# EAGLE board Xibeca44 (EAGLE 9.6.2)
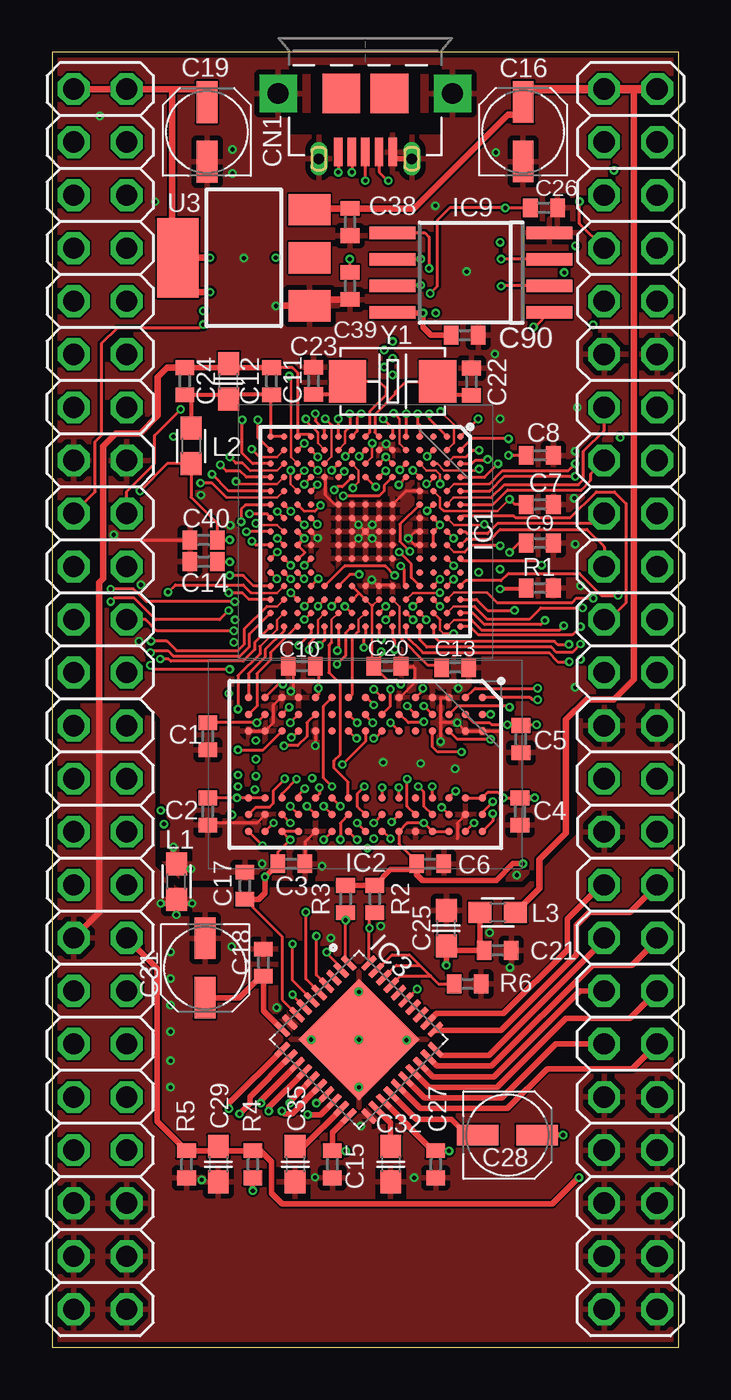
[diagram p2: board, top side]
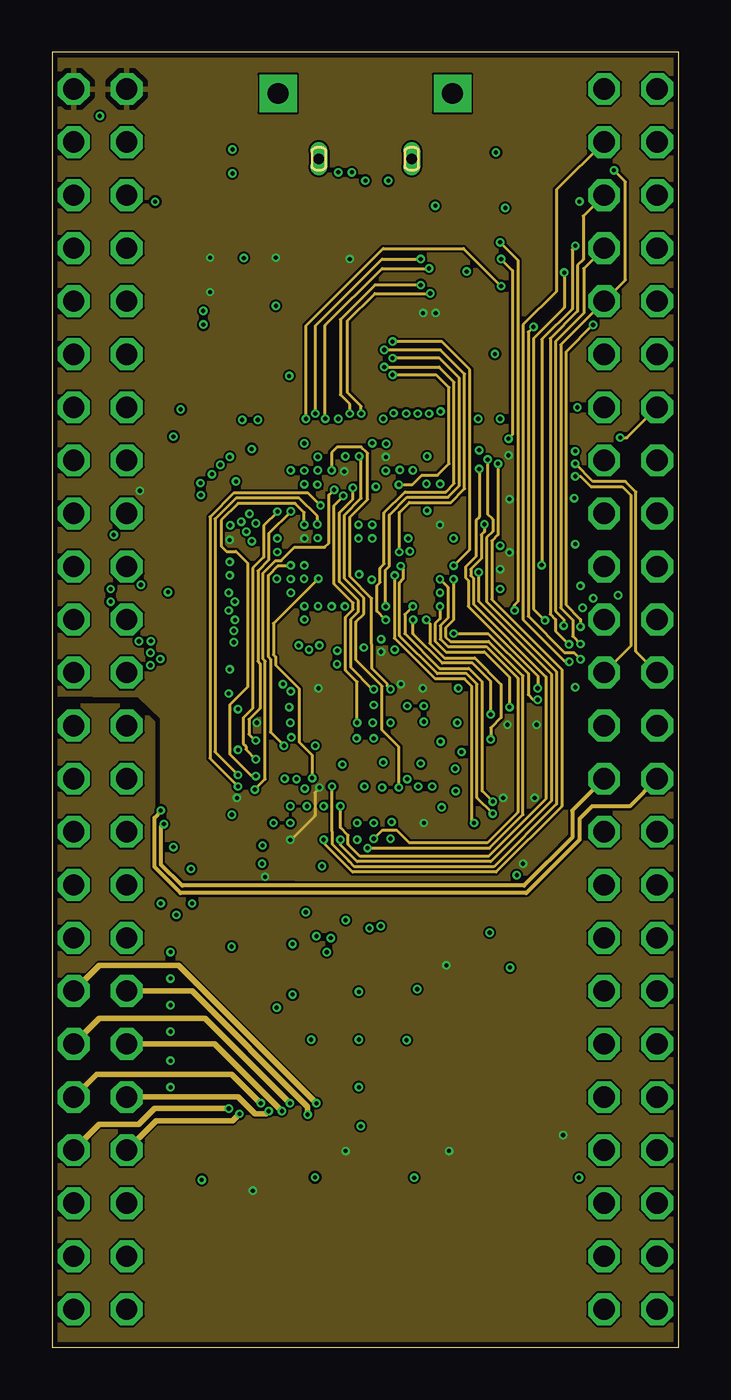
[diagram p3: board, inner layer InnerTop]
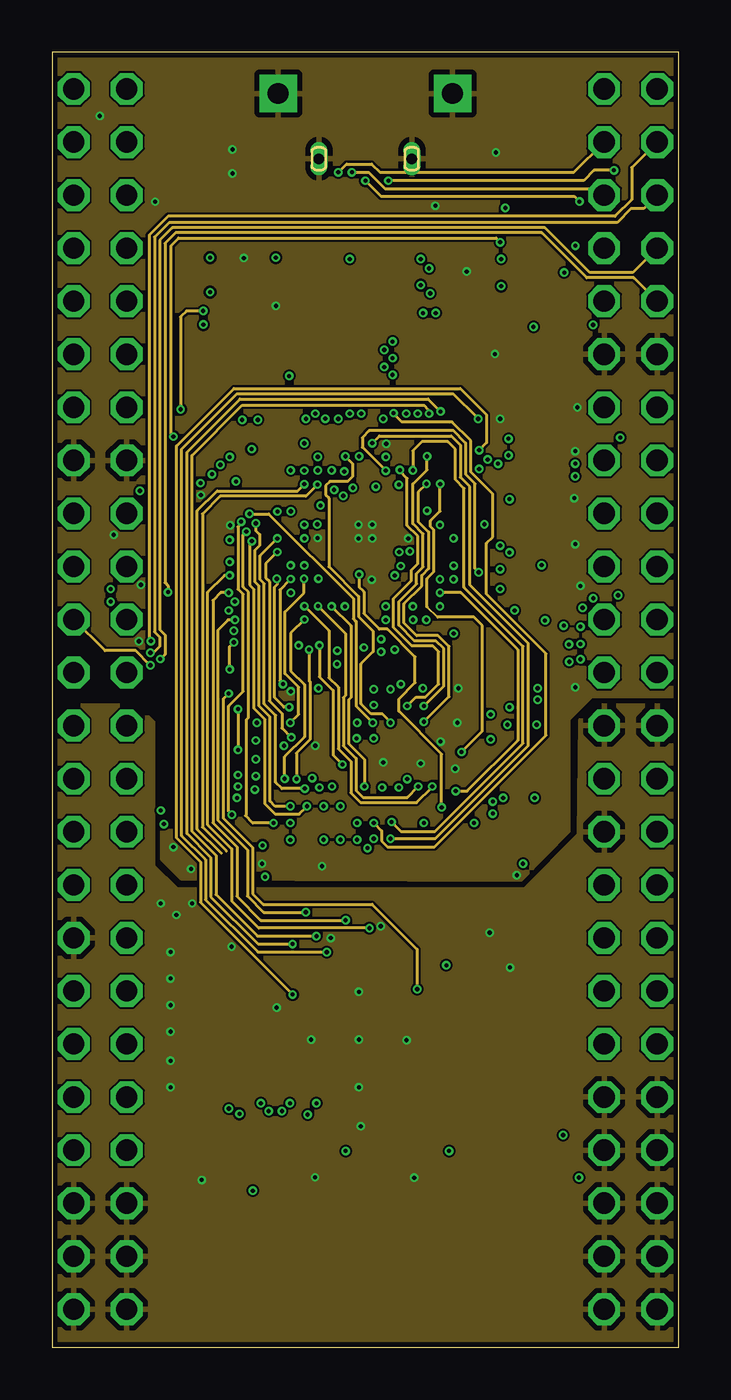
[diagram p4: board, inner layer InnerBottom]
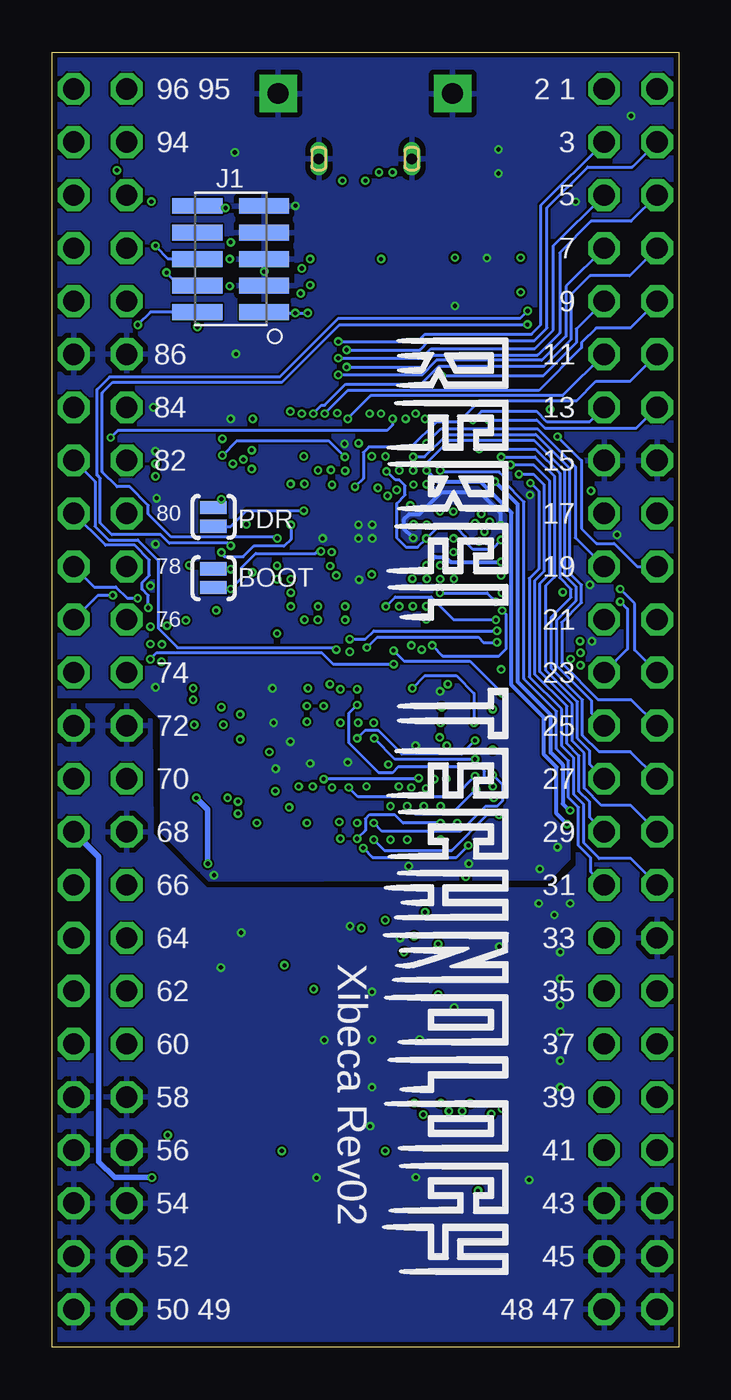
[diagram p5: board, bottom side, seen from below]

Size 30 x 62 mm. Coordinates in mm from the lower left corner, seen from the top.
Outline: 0,0 30,0 30,62 0,62 0,0
Copper layers (1*2*15*16): Top 0.035mm / dielectric 0.2mm / InnerTop 0.0175mm / dielectric 0.3mm / InnerBottom 0.0175mm / dielectric 0.2mm / Bottom 0.035mm
Design rules "PCBWay_4layer_20210129 *": minimum track width 0.1mm, minimum drill 0.2mm, track to track 0.1mm, track to pad 0.1mm, pad to pad 0.1mm, via to via 0.1mm, smd to smd 0mil, copper to edge 10mil, drill to drill 0.25mm, minimum pad ring 6mil, minimum via ring 4mil, stop-mask expansion 2mil, vias tented up to drill 25mil, thermal gap 10mil
Net classes: 1 power: width 0.178 mm, drill 0.305 mm, clearance 0.178 mm to class 0, clearance 0.178 mm

## Footprints (pad centres in the part's own frame; a part is rotated, then mirrored left to right if it is on the bottom)
SJ_2S-NO = smd 0.635 x 1.27: 1 -0.45,0; 2 0.45,0
C0402 = smd 0.7 x 0.9: 1 -0.65,0; 2 0.65,0
C0603 = smd 1.1 x 1: 1 -0.85,0; 2 0.85,0
UD-4X5,8_NICHICON = smd 2 x 1: + 1.425,0; - -1.425,0
HRS_ZX62RD-AB-5P8 = smd 0.4 x 1.35: 1 1.3,2.275; 2 0.65,2.275; 3 0,2.275; 4 -0.65,2.275; 5 -1.3,2.275 | smd 1.8 x 1.9: D_0 -1.15,-0.525; D_1 1.15,-0.525 | drill 1 pad 1.8 square: G -4.175,-0.525; G2 4.175,-0.525 | drill 0.5 long: G3 -2.225,2.6; G4 2.225,2.6
BGA201C65P15X15_1000X1000X60 = smd 0.3 x 0.3: A1 -4.55,4.55; A2 -3.9,4.55; A3 -3.25,4.55; A4 -2.6,4.55; A5 -1.95,4.55; A6 -1.3,4.55; A7 -0.65,4.55; A8 0,4.55; A9 0.65,4.55; A10 1.3,4.55; A11 1.95,4.55; A12 2.6,4.55; A13 3.25,4.55; A14 3.9,4.55; A15 4.55,4.55; B1 -4.55,3.9; B2 -3.9,3.9; B3 -3.25,3.9; B4 -2.6,3.9; B5 -1.95,3.9; B6 -1.3,3.9; B7 -0.65,3.9; B8 0,3.9; B9 0.65,3.9; B10 1.3,3.9; B11 1.95,3.9; B12 2.6,3.9; B13 3.25,3.9; B14 3.9,3.9; B15 4.55,3.9; C1 -4.55,3.25; C2 -3.9,3.25; C3 -3.25,3.25; C4 -2.6,3.25; C5 -1.95,3.25; C6 -1.3,3.25; C7 -0.65,3.25; C8 0,3.25; C9 0.65,3.25; C10 1.3,3.25; C11 1.95,3.25; C12 2.6,3.25; C13 3.25,3.25; C14 3.9,3.25; C15 4.55,3.25; D1 -4.55,2.6; D2 -3.9,2.6; D3 -3.25,2.6; D4 -2.6,2.6; D5 -1.95,2.6; D6 -1.3,2.6; D7 -0.65,2.6; D8 0,2.6; D9 0.65,2.6; D10 1.3,2.6; D11 1.95,2.6; D12 2.6,2.6; D13 3.25,2.6; D14 3.9,2.6; D15 4.55,2.6; E1 -4.55,1.95; E2 -3.9,1.95; E3 -3.25,1.95; E4 -2.6,1.95; E12 2.6,1.95; E13 3.25,1.95; E14 3.9,1.95; E15 4.55,1.95; F1 -4.55,1.3; F2 -3.9,1.3; F3 -3.25,1.3; F4 -2.6,1.3; F6 -1.3,1.3; F7 -0.65,1.3; F8 0,1.3; F9 0.65,1.3; F10 1.3,1.3; F12 2.6,1.3; F13 3.25,1.3; F14 3.9,1.3; F15 4.55,1.3; G1 -4.55,0.65; G2 -3.9,0.65; G3 -3.25,0.65; G4 -2.6,0.65; G6 -1.3,0.65; G7 -0.65,0.65; G8 0,0.65; G9 0.65,0.65; G10 1.3,0.65; G12 2.6,0.65; G13 3.25,0.65; G14 3.9,0.65; G15 4.55,0.65; H1 -4.55,0; H2 -3.9,0; H3 -3.25,0; H4 -2.6,0; H6 -1.3,0; H7 -0.65,0; H8 0,0; H9 0.65,0; H10 1.3,0; H12 2.6,0; H13 3.25,0; H14 3.9,0; H15 4.55,0; J1 -4.55,-0.65; J2 -3.9,-0.65; J3 -3.25,-0.65; J4 -2.6,-0.65; J6 -1.3,-0.65; J7 -0.65,-0.65; J8 0,-0.65; J9 0.65,-0.65; J10 1.3,-0.65; J12 2.6,-0.65; J13 3.25,-0.65; J14 3.9,-0.65; J15 4.55,-0.65; K1 -4.55,-1.3; K2 -3.9,-1.3; K3 -3.25,-1.3; K4 -2.6,-1.3; K6 -1.3,-1.3; K7 -0.65,-1.3; K8 0,-1.3; K9 0.65,-1.3; K10 1.3,-1.3; K12 2.6,-1.3; K13 3.25,-1.3; K14 3.9,-1.3; K15 4.55,-1.3; L1 -4.55,-1.95; L2 -3.9,-1.95; L3 -3.25,-1.95; L4 -2.6,-1.95; L12 2.6,-1.95; L13 3.25,-1.95; L14 3.9,-1.95; L15 4.55,-1.95; M1 -4.55,-2.6; M2 -3.9,-2.6; M3 -3.25,-2.6; M4 -2.6,-2.6; M5 -1.95,-2.6; M6 -1.3,-2.6; M7 -0.65,-2.6; M8 0,-2.6; M9 0.65,-2.6; M10 1.3,-2.6; M11 1.95,-2.6; M12 2.6,-2.6; M13 3.25,-2.6; M14 3.9,-2.6; M15 4.55,-2.6; N1 -4.55,-3.25; N2 -3.9,-3.25; N3 -3.25,-3.25; N4 -2.6,-3.25; N5 -1.95,-3.25; N6 -1.3,-3.25; N7 -0.65,-3.25; N8 0,-3.25; N9 0.65,-3.25; N10 1.3,-3.25; N11 1.95,-3.25; N12 2.6,-3.25; N13 3.25,-3.25; N14 3.9,-3.25; N15 4.55,-3.25; P1 -4.55,-3.9; P2 -3.9,-3.9; P3 -3.25,-3.9; P4 -2.6,-3.9; P5 -1.95,-3.9; P6 -1.3,-3.9; P7 -0.65,-3.9; P8 0,-3.9; P9 0.65,-3.9; P10 1.3,-3.9; P11 1.95,-3.9; P12 2.6,-3.9; P13 3.25,-3.9; P14 3.9,-3.9; P15 4.55,-3.9; R1 -4.55,-4.55; R2 -3.9,-4.55; R3 -3.25,-4.55; R4 -2.6,-4.55; R5 -1.95,-4.55; R6 -1.3,-4.55; R7 -0.65,-4.55; R8 0,-4.55; R9 0.65,-4.55; R10 1.3,-4.55; R11 1.95,-4.55; R12 2.6,-4.55; R13 3.25,-4.55; R14 3.9,-4.55; R15 4.55,-4.55
BGA90C80P9X15_800X1300X100 = smd 0.37 x 0.37: A1 -3.2,5.6; A2 -2.4,5.6; A3 -1.6,5.6; A7 1.6,5.6; A8 2.4,5.6; A9 3.2,5.6; B1 -3.2,4.8; B2 -2.4,4.8; B3 -1.6,4.8; B7 1.6,4.8; B8 2.4,4.8; B9 3.2,4.8; C1 -3.2,4; C2 -2.4,4; C3 -1.6,4; C7 1.6,4; C8 2.4,4; C9 3.2,4; D1 -3.2,3.2; D2 -2.4,3.2; D3 -1.6,3.2; D7 1.6,3.2; D8 2.4,3.2; D9 3.2,3.2; E1 -3.2,2.4; E2 -2.4,2.4; E3 -1.6,2.4; E7 1.6,2.4; E8 2.4,2.4; E9 3.2,2.4; F1 -3.2,1.6; F2 -2.4,1.6; F3 -1.6,1.6; F7 1.6,1.6; F8 2.4,1.6; F9 3.2,1.6; G1 -3.2,0.8; G2 -2.4,0.8; G3 -1.6,0.8; G7 1.6,0.8; G8 2.4,0.8; G9 3.2,0.8; H1 -3.2,0; H2 -2.4,0; H3 -1.6,0; H7 1.6,0; H8 2.4,0; H9 3.2,0; J1 -3.2,-0.8; J2 -2.4,-0.8; J3 -1.6,-0.8; J7 1.6,-0.8; J8 2.4,-0.8; J9 3.2,-0.8; K1 -3.2,-1.6; K2 -2.4,-1.6; K3 -1.6,-1.6; K7 1.6,-1.6; K8 2.4,-1.6; K9 3.2,-1.6; L1 -3.2,-2.4; L2 -2.4,-2.4; L3 -1.6,-2.4; L7 1.6,-2.4; L8 2.4,-2.4; L9 3.2,-2.4; M1 -3.2,-3.2; M2 -2.4,-3.2; M3 -1.6,-3.2; M7 1.6,-3.2; M8 2.4,-3.2; M9 3.2,-3.2; N1 -3.2,-4; N2 -2.4,-4; N3 -1.6,-4; N7 1.6,-4; N8 2.4,-4; N9 3.2,-4; P1 -3.2,-4.8; P2 -2.4,-4.8; P3 -1.6,-4.8; P7 1.6,-4.8; P8 2.4,-4.8; P9 3.2,-4.8; R1 -3.2,-5.6; R2 -2.4,-5.6; R3 -1.6,-5.6; R7 1.6,-5.6; R8 2.4,-5.6; R9 3.2,-5.6
QFN50P600X600X100-41N = smd 0.84 x 0.26: 1 -2.935,2.25; 2 -2.935,1.75; 3 -2.935,1.25; 4 -2.935,0.75; 5 -2.935,0.25; 6 -2.935,-0.25; 7 -2.935,-0.75; 8 -2.935,-1.25; 9 -2.935,-1.75; 10 -2.935,-2.25; 21 2.935,-2.25; 22 2.935,-1.75; 23 2.935,-1.25; 24 2.935,-0.75; 25 2.935,-0.25; 26 2.935,0.25; 27 2.935,0.75; 28 2.935,1.25; 29 2.935,1.75; 30 2.935,2.25 | smd 0.26 x 0.84: 11 -2.25,-2.935; 12 -1.75,-2.935; 13 -1.25,-2.935; 14 -0.75,-2.935; 15 -0.25,-2.935; 16 0.25,-2.935; 17 0.75,-2.935; 18 1.25,-2.935; 19 1.75,-2.935; 20 2.25,-2.935; 31 2.25,2.935; 32 1.75,2.935; 33 1.25,2.935; 34 0.75,2.935; 35 0.25,2.935; 36 -0.25,2.935; 37 -0.75,2.935; 38 -1.25,2.935; 39 -1.75,2.935; 40 -2.25,2.935 | smd 4.1 x 4.1: 41 0,0
SO8W = smd 0.6 x 2.2: 1 -1.905,-3.75; 2 -0.635,-3.75; 3 0.635,-3.75; 4 1.905,-3.75; 5 1.905,3.75; 6 0.635,3.75; 7 -0.635,3.75; 8 -1.905,3.75
2X5_1.27MM_SMD = smd 2.4 x 0.76: 1 -1.6,2.54; 2 1.6,2.54; 3 -1.6,1.27; 4 1.6,1.27; 5 -1.6,0; 6 1.6,0; 7 -1.6,-1.27; 8 1.6,-1.27; 9 -1.6,-2.54; 10 1.6,-2.54
2X24 = drill 1.016 octagon: 1 -27.94,-1.27; 2 -27.94,1.27; 3 -25.4,-1.27; 4 -25.4,1.27; 5 -22.86,-1.27; 6 -22.86,1.27; 7 -20.32,-1.27; 8 -20.32,1.27; 9 -17.78,-1.27; 10 -17.78,1.27; 11 -15.24,-1.27; 12 -15.24,1.27; 13 -12.7,-1.27; 14 -12.7,1.27; 15 -10.16,-1.27; 16 -10.16,1.27; 17 -7.62,-1.27; 18 -7.62,1.27; 19 -5.08,-1.27; 20 -5.08,1.27; 21 -2.54,-1.27; 22 -2.54,1.27; 23 0,-1.27; 24 0,1.27; 25 2.54,-1.27; 26 2.54,1.27; 27 5.08,-1.27; 28 5.08,1.27; 29 7.62,-1.27; 30 7.62,1.27; 31 10.16,-1.27; 32 10.16,1.27; 33 12.7,-1.27; 34 12.7,1.27; 35 15.24,-1.27; 36 15.24,1.27; 37 17.78,-1.27; 38 17.78,1.27; 39 20.32,-1.27; 40 20.32,1.27; 41 22.86,-1.27; 42 22.86,1.27; 43 25.4,-1.27; 44 25.4,1.27; 45 27.94,-1.27; 46 27.94,1.27; 47 30.48,-1.27; 48 30.48,1.27
0603 = smd 1.1 x 1: 1 -0.85,0; 2 0.85,0
R0402 = smd 0.7 x 0.9: 1 -0.65,0; 2 0.65,0
SOT223 = smd 1.5 x 2: 1 -2.3,-3.15; 2 0,-3.15; 3 2.3,-3.15 | smd 3.8 x 2: 4 0,3.15
X2-SMD-5.0X3.2X1.3MM = smd 1.778 x 2.032: 1 -2.159,0; 2 2.159,0

## Placement (x,y rotation side)
BOOT  SOLDERJUMPERNO  [SJ_2S-NO]  22.27,36.82 270 bottom
BOOT1  SOLDERJUMPERNO  [SJ_2S-NO]  22.27,39.75 270 bottom
C1  100n  [C0402]  7.45,29.25 270 top
C2  100n  [C0402]  7.45,25.65 270 top
C3  100n  [C0402]  11.45,23.15 0 top
C4  100n  [C0402]  22.4,25.65 270 top
C5  100n  [C0402]  22.44,29.11 270 top
C6  100n  [C0402]  18.1,23.15 0 top
C7  100n  [C0402]  23.35,40.35 0 top
C8  100n  [C0402]  23.35,42.7 0 top
C9  100n  [C0402]  23.35,38.5 0 top
C10  100n  [C0402]  11.95,32.6 180 top
C11  100n  [C0402]  10.5,46.25 90 top
C12  1u  [C0603]  8.45,46.25 90 top
C13  2u2  [C0402]  19.3,32.55 0 top
C14  2u2  [C0402]  7.25,37.61 180 top
C15  100n  [C0402]  13.42,8.76 270 top
C16  10u  [UD-4X5,8_NICHICON]  22.55,58.19 90 top
C17  100n  [C0402]  9.22,22.1 90 top
C18  100n  [C0402]  10.11,18.41 90 top
C19  10u  [UD-4X5,8_NICHICON]  7.41,58.18 90 top
C20  100n  [C0402]  16.05,32.6 0 top
C21  100n  [C0402]  21.33,19 0 top
C22  22p  [C0402]  20.08,46.23 90 top
C23  22p  [C0402]  12.52,46.27 90 top
C24  100n  [C0402]  6.35,46.25 90 top
C25  10u  [C0603]  18.88,20.07 90 top
C26  100n  [C0402]  23.55,54.55 0 top
C27  100n  [C0402]  18.37,8.76 270 top
C28  10u  [UD-4X5,8_NICHICON]  21.8,10.16 0 top
C29  10u  [C0603]  7.96,8.76 270 top
C31  10u  [UD-4X5,8_NICHICON]  7.32,18.16 270 top
C32  10u  [C0603]  16.21,8.76 270 top
C35  1u  [C0603]  11.64,8.76 270 top
C38  100n  [C0402]  14.26,53.87 90 top
C39  100n  [C0402]  14.26,50.82 270 top
C40  100n  [C0402]  7.25,38.65 180 top
C90  100n  [C0402]  19.75,48.45 0 top
CN1  [HRS_ZX62RD-AB-5P8]  15,59.5 180 top
IC1  STM32H743IIK6  [BGA201C65P15X15_1000X1000X60]  15,39.05 270 top
IC2  AS4C16M32MSA-6BIN  [BGA90C80P9X15_800X1300X100]  15,27.9 270 top
IC3  CS4244  [QFN50P600X600X100-41N]  14.69,14.73 315 top
IC9  S25FL064LABMFI010  [SO8W]  20.05,51.45 90 top
J1  FTS-105-01-F-DV  [2X5_1.27MM_SMD]  21.45,52.1 180 bottom
JP1  [2X24]  2.3,32.3 270 top
JP2  [2X24]  27.7,32.3 270 top
L1  Ferrite Bead  [0603]  5.95,22.3 90 top
L2  Ferrite Bead  [0603]  6.65,43.15 270 top
L3  Ferrite Bead  [0603]  21.33,20.82 0 top
R1  10k  [R0402]  23.35,36.35 180 top
R2  4k7  [R0402]  15.45,21.46 90 top
R3  4k7  [R0402]  14.05,21.46 90 top
R4  100k  [R0402]  9.61,8.76 270 top
R5  100k  [R0402]  6.43,8.76 90 top
R6  10k  [R0402]  19.89,17.4 180 top
U3  TLV1117LV33DCYR  [SOT223]  9.17,52.16 90 top
Y1  8MHz  [X2-SMD-5.0X3.2X1.3MM]  16.3,46.24 0 top

## Tracks (layer width: path | path; a pad name or v marks a point on that pad's centre or on a via)
+3V3  (via drill 0.2)
  Top 0.13: IC1.G13 15.35,35.5 | 15.3,35.5 IC1.H13 | 15.32,32.68 15.32,35.5 | v21.9,40.6 21.33,40.03 18.76,40.03 18.58,40.21 18.58,40.67 IC1.C5
  Top 0.15: v12.8,26.8 12.8,26.5 IC2.L7 | IC2.M9 IC2.N9 v11.4,24.3 v11.4,24.29 10.8,23.69 C3.1 | IC2.B7 IC2.A7 20.85,26.55 21.35,26.55 v21.6,26.3 C4.1 | IC2.P7 IC2.R7 v8.85,26.3 C2.1 | IC2.P2 v9.8,29.9 C1.1 | IC2.L1 12.75,31.25 v12.75,31.55 12.75,32.45 C10.1 | v17.75,31.55 17.75,31.45 IC2.E1 | IC2.C9 IC2.D9 v17.8,25.1 17,25.1 IC2.F9 16.6,24.1 17.45,23.25 C6.1 | 15.35,35.5 15.32,35.5 15.3,35.5 | v13.99,41.93 IC1.K4 | IC1.N9 12.1,38.05 11.8,37.75 IC1.N10 | IC1.G3 v15.98,42.62 IC1.F3 | C39.1 v14.26,52.09 v14.25,52.1 | IC1.J12 14.7,36.1 | IC1.J13 14.4,35.8 14.7,36.1 | IC1.H13 14.7,36.1 | v8.5,38.65 C40.1 7.9,39.45 6.65,40.7 L2.2 5.5,42.3 v4.2,41 | C20.1 15.32,32.68 | C9.1 22.35,38.5 v21.9,38.05 | C8.1 v21.85,42.7 | v21.9,40.6 22.13,40.37 22.68,40.37 | v23.2,29.8 22.47,29.8 C5.1 22.4,29.8 v21.8,29.8 21.05,29.8 20.96,29.89 20.2,29.89 IC2.B2 | v15.75,33.3 15.75,33.1 15.4,32.75 C20.1 | C20.1 16.05,31.95 16.5,31.95 v16.7,31.75 | IC1.C9 IC1.C8 v18.57,39.37 IC1.C7 | IC3.8 11.01,16.64 11.01,19.66 C17.1
  Top 0.152: C7.1 22.68,40.37
  Top 0.2: IC1.N9 v12.08,38.72 IC1.N8
  Top 0.254: 7.38,60.24 7.41,60.21 C19.+ | IC9.8 16.33,49.51 v17.76,49.51 17.76,48.84 18.15,48.45 C90.1 | v23.1,26.3 C4.1 | C17.1 9.88,21.45 10.19,21.76 v10.19,22.52 10.8,23.13 C3.1 | R3.2 R2.2 16.21,22.88 17.18,22.88 C6.1 17.45,22.64 17.73,22.35 21.27,22.35 22.07,23.16 v22.54,23.16 v22.55,23.15
  Top 0.305: JP1.1 JP1.2 5.75,60.24 | 5.75,60.24 7.38,60.24 | U3.4 5.75,52.43 5.75,60.24 | v7.56,50.51 6.56,50.51 | v7.56,52.16 6.06,52.16 6.02,52.2
  Top 0.406: 6.02,53.15 6.02,52.2 U3.4 6.02,51.05 6.56,50.51
  InnerTop 0.15: v12.8,26.8 12.8,26.78 12.58,26.56 12.58,25.44 11.46,24.32 11.43,24.32 v11.4,24.29
  Bottom 0.15: J1.1 19.8,49.51 v17.76,49.51 | v8.5,38.65 8.95,38.2 9.85,38.2 10.2,38.55 10.2,38.8 10.6,39.2 11.6,39.2 v12.08,38.72 12.5,38.3 13.05,38.3 13.5,38.75 13.5,40.4 13.1,40.8 13.1,41.25 13.37,41.52 13.56,41.52 13.96,41.93 v13.99,41.93 | v21.45,37.25 21.47,37.27 BOOT.1 | v15.98,42.62 16.76,43.4 21.15,43.4 v21.85,42.7 | BOOT1.1 22.27,40.23 v21.9,40.6 | v12.75,31.55 12.15,32.15 10.65,32.15 9.8,31.3 v9.8,29.9 | v21.9,38.05 21.9,38 21.75,37.85 20.85,37.85 20.35,38.35 18.9,38.35 18.57,38.68 v18.57,39.37
  Bottom 0.254: v23.1,26.3 22.55,25.75 v22.55,23.15
  other vias: 10.71,52.16 18.36,49.51
  pour InnerTop: -0.2,62 30,62 30,31.2 25.8,31.2 24.7,30.1 24.7,24.72 22.41,22.39 6.22,22.46 5.3,23.4 5.3,30.16 4.18,31.24 -0.24,31.27
+5V
  Top 0.305: L3.2 23.33,21.97 23.33,23.36 24.6,24.63 24.6,30.04 25.57,31.02 26.9,31.02 27.85,31.97 27.85,60.24 | 22.61,60.24 22.6,60.25 22.55,60.2 C16.+ 22.55,59.37 22.2,59.02 21.82,59.02 17.32,54.52 C38.2 12.38,54.52 12.26,54.39
  Top 0.406: U3.3 12.26,54.39 | JP2.2 27.85,60.24 JP2.1 22.61,60.24
+A3V3
  Top 0.15: C11.1 10.45,45.55 IC1.R1 IC1.P1
  Top 0.2: C24.1 6.65,45.3 L2.1
  Top 0.203: C11.1 8.65,45.6 C12.1 8.25,45.6 C24.1
+A5V  (via drill 0.2)
  Top 0.254: IC3.20 13.42,10.28 C15.1 14.04,9.41 v14.05,9.4 | IC3.23 18.24,9.41 C27.1 18.99,9.41 v19,9.4 | L3.1 20.48,19.2 C21.1 19.09,19 C25.1 v18.88,18.29 | C28.+ v24.46,10.16 | R4.2 v9.61,7.49
  pour InnerTop: -0.3,30.7 4,30.7 4.8,29.9 4.8,23.01 5.95,21.9 22.65,21.9 25.25,24.5 25.31,30 26.01,30.7 29.99,30.7 30.29,-5.14 -0.3,-5.08
ADC_I2C_SCL  (via drill 0.2)
  Top 0.15: IC1.R12 9.65,36.45 9.15,36.95 v8.5,36.95 | IC3.40 15.17,20.04 | 15.17,20.04 v15.19,20.07 | R2.1 15.17,20.54 15.17,20.04
  InnerBottom 0.15: v8.5,36.95 8.25,36.95 7.45,36.15 7.45,25.01 8.6,23.86 8.6,21.36 9.89,20.07 v15.19,20.07
ADC_I2C_SDA  (via drill 0.2)
  Top 0.15: IC1.R13 9.42,35.8 9.1,36.12 v8.45,36.12 | IC3.1 14.05,18.55 v14.05,20.45 R3.1
  InnerBottom 0.15: v8.45,36.12 8.07,36.12 7.7,35.75 7.7,25.11 8.85,23.96 8.85,21.59 9.99,20.45 v14.05,20.45
ADC_IN3  (via drill 0.2)
  Top 0.13: IC1.P3 10.77,41.97 9.48,41.97
  Top 0.15: 9.48,41.97 9.13,42.32 8.8,42.32 v8.5,42.62
  Bottom 0.15: JP1.28 4.27,27.92 4.27,28.57 4.85,29.15 4.85,30.9 6.35,32.4 6.35,36.47 5.95,36.87 5.95,41.7 6.87,42.62 v8.5,42.62
ADC_IN4  (via drill 0.2)
  Top 0.13: IC1.N5 11.42,41.33 v11.42,41.98
  Bottom 0.15: JP1.32 4.22,22.79 4.22,23.44 4.8,24.02 4.8,25.85 5.27,26.32 5.27,28.07 5.85,28.65 5.85,30.45 7.4,32 7.4,40.47 8.35,41.42 8.35,41.65 8.6,41.9 11.34,41.9 v11.42,41.98
ADC_IN5  (via drill 0.2)
  Top 0.15: IC1.R4 9.3,41.65 9,41.95 8.35,41.95 v8.05,42.25
  Bottom 0.15: JP1.29 2.3,25.95 3.7,25.95 4.52,26.77 4.52,28.45 5.1,29.03 5.1,30.79 6.65,32.34 6.65,36.56 6.2,37.01 6.2,41.5 6.95,42.25 v8.05,42.25
ADC_IN8  (via drill 0.2)
  Top 0.13: IC1.P5 10.78,40.68 8.34,40.68
  Top 0.15: 8.34,40.68 7.65,41.37 v7.1,41.37
  Bottom 0.15: JP1.31 2.29,23.4 3.8,23.4 4.55,24.15 4.55,26 5.02,26.47 5.02,28.21 5.6,28.79 5.6,30.55 7.15,32.1 7.15,36.81 6.7,37.26 6.7,41 7.07,41.37 v7.1,41.37
ADC_IN9  (via drill 0.2)
  Top 0.15: IC1.R5 8.45,41 v7.65,41.8
  Bottom 0.15: JP1.30 4.27,25.38 4.27,26.12 4.77,26.62 4.77,28.32 5.35,28.9 5.35,30.69 6.9,32.24 6.9,36.69 6.45,37.14 6.45,41.3 6.95,41.8 v7.65,41.8
ADC_IN10  (via drill 0.2)
  Top 0.15: IC1.M2 v12.72,42.63
  Bottom 0.15: JP1.25 2.27,31 3.85,31 5.6,32.75 5.6,34.7 4.65,35.65 4.65,36.5 5.2,37.05 5.2,42.06 6.84,43.7 11.1,43.7 12.17,42.63 v12.72,42.63
ADC_IN11  (via drill 0.2)
  Top 0.15: IC1.M3 v12.72,41.98
  Bottom 0.15: JP1.26 4.17,30.36 4.17,30.96 5.85,32.64 5.85,34.8 4.9,35.75 4.9,36.4 5.45,36.95 5.45,41.95 6.9,43.4 11,43.4 12.05,42.35 12.35,42.35 v12.72,41.98
ADC_IN14  (via drill 0.2)
  Top 0.13: IC1.P2 10.77,42.62 9.93,42.62
  Top 0.15: 9.93,42.62 v9.55,43
  Bottom 0.15: JP1.27 2.31,28.5 3.81,28.5 4.6,29.29 4.6,31 6.1,32.5 6.1,34.95 5.15,35.9 5.15,36.3 5.7,36.85 5.7,41.85 6.85,43 v9.55,43
ADC_RST  (via drill 0.2)
  Top 0.15: IC1.K15 13.7,33.4 v13.65,33.35 | v17.48,17.14 17.45,17.14 IC3.35
  InnerBottom 0.15: v8.45,31.3 8.2,31.05 8.2,25.32 9.6,23.92 9.6,21.71 10.1,21.21 15.32,21.21 17.48,19.05 v17.48,17.14
  Bottom 0.15: v13.65,33.35 13.15,32.85 10,32.85 v8.45,31.3
ADC_SPI_MISO  (via drill 0.2)
  Top 0.15: IC1.M4 v12.07,41.32
  InnerBottom 0.15: 8.1,23.65 6.95,24.8 6.95,40.05 7.9,41 11.76,41 v12.07,41.31 v12.07,41.32
ADC_SPI_MOSI  (via drill 0.2)
  Top 0.15: IC1.M5 v12.7,41.3
  InnerBottom 0.15: 8.35,23.76 7.2,24.9 7.2,39.9 8.05,40.75 12.15,40.75 v12.7,41.3
AGND  (via drill 0.2)
  Top 0.15: IC1.M1 12.3,43.7 11.85,43.7 IC1.N1 11.75,46.65 11.5,46.9 C11.2 | 8.6,46.9 C12.2
  Top 0.254: 5.9,21.25 5.95,21.25 v5.95,20.7 | 5.9,21.25 v5.2,21.25 | 5.9,21.25 5.9,21.4 L1.1 6.15,21.25 v6.7,21.25 | C11.2 8.6,46.9 | C24.2 8.25,46.9 C12.2
  Top 0.305: C24.2 5.5,46.9 5.05,46.45 5.05,44.6 4.2,43.75 3.05,43.75 2.45,43.15 2.45,36.8 2.25,36.6 2.25,20.82 JP1.33
  other vias: 17.34,8.12 5.67,13.72 5.67,12.45 14.69,17.02 7.16,8.01 12.59,8.13 21.92,18.18 13.34,19.6 14.77,10.58 16.97,14.7 5.67,15.11 14.69,12.45 20.95,19.85 15.74,20.16 12.4,14.73 10.75,16.26 8.59,19.18 14.69,14.73 5.67,16.38 5.67,17.65 5.67,18.92
  pour InnerBottom: -0.3,30.7 4,30.7 4.8,29.9 4.8,23.01 5.95,21.9 22.65,21.9 25.25,24.5 25.31,30 26.01,30.7 29.99,30.7 30.28,-3.87 -0.3,-3.81
  pour Top: -0.3,30.7 4,30.7 4.8,29.9 4.8,23 5.94,21.9 22.65,21.9 25.25,24.5 25.31,30 26.01,30.7 29.99,30.7 30.3,-6.41 -0.3,-6.35
  pour Bottom: -0.3,30.7 4,30.7 4.8,29.9 4.8,23.01 5.95,21.9 22.65,21.9 25.25,24.5 25.31,30 26.01,30.7 29.99,30.7 30.27,-2.6 -0.3,-2.54
AIN1+  (via drill 0.2)
  Top 0.254: IC3.17 12.7,11.68 v12.65,11.68
  InnerTop 0.254: v12.65,11.68 6.05,18.29 2.26,18.29 JP1.35
AIN1-  (via drill 0.2)
  Top 0.254: IC3.18 12.86,11.14 v12.23,11.14
  InnerTop 0.254: JP1.36 6.69,17.06 12.23,11.52 v12.23,11.14
AIN2+  (via drill 0.2)
  Top 0.254: IC3.15 11.38,11.78 v11.38,11.68
  InnerTop 0.254: JP1.37 2.26,15.75 7.32,15.75 v11.38,11.68
AIN2-  (via drill 0.2)
  Top 0.254: IC3.16 11.48,11.18 11.13,11.18 v11,11.3
  InnerTop 0.254: v11,11.3 7.79,14.52 JP1.38
AIN3+  (via drill 0.2)
  Top 0.254: IC3.13 9.99,11.8 v9.99,11.68
  InnerTop 0.254: v9.99,11.68 8.6,13.07 2.12,13.07 JP1.39
AIN3-  (via drill 0.2)
  Top 0.254: IC3.14 10.37,11.47 v10.37,11.3
  InnerTop 0.254: v10.37,11.3 10.24,11.18 9.71,11.18 8.9,11.98 JP1.40
AIN4+  (via drill 0.2)
  Top 0.254: IC3.11 8.46,11.69 v8.46,11.43
  InnerTop 0.15: JP1.41 1.03,9.46
  InnerTop 0.254: v8.46,11.43 4.91,11.43 4.15,10.67 2.24,10.67 1.03,9.46
AIN4-  (via drill 0.2)
  Top 0.254: IC3.12 9.48,12 9.48,11.68 v8.97,11.18
  InnerTop 0.254: v8.97,11.18 8.63,10.84 4.97,10.84 JP1.42
AOUT1+
  Top 0.254: JP2.31 26.3,22.14 24.66,20.5 24.66,19.04 21.6,15.97 18.4,15.97 IC3.32
AOUT1-
  Top 0.254: IC3.31 18.4,15.17 21.48,15.17 25.1,18.8 25.1,20.19 25.73,20.83 27.66,20.83 JP2.32
AOUT2+
  Top 0.254: IC3.30 18.63,13.97 20.91,13.97 26.43,19.49 JP2.33
AOUT2-
  Top 0.254: IC3.29 18.43,13.46 21.04,13.46 25.86,18.29 27.77,18.29 28.97,19.49 JP2.34
AOUT3+
  Top 0.254: IC3.28 18.23,12.95 21.16,12.95 25.27,17.06 JP2.35
AOUT3-
  Top 0.254: IC3.27 18.03,12.45 21.29,12.45 24.59,15.75 27.66,15.75 JP2.36
AOUT4+
  Top 0.254: IC3.26 17.83,11.94 21.54,11.94 24.13,14.52 JP2.37
AOUT4-
  Top 0.254: IC3.25 17.63,11.43 21.8,11.43 23.7,13.34 27.79,13.34 JP2.38
AREF  (via drill 0.2)
  Top 0.254: JP1.34 5.03,18.14 5.03,10.81 R5.2 7.75,9.41 C29.1 8.15,9.41 R4.1 9.97,9.41 10.49,8.89 10.49,7.37 11,6.86 23.96,6.86 v25.23,8.13
  Bottom 0.254: JP2.30 27.77,23.48 27.77,8.89 27,8.13 v25.23,8.13
BOOT  (via drill 0.2)
  Top 0.15: IC1.D6 16.65,39.4 16.65,38.58 v17.12,38.11 v17.13,38.11
  Top 0.2: R1.2 22.45,36.3 v21.45,36.3
  Bottom 0.15: v17.13,38.11 17.29,38.11 17.4,38 20.25,38 20.95,37.3 20.95,36.8 v21.45,36.3 22.21,36.3 BOOT.2
DAC1  (via drill 0.2)
  Top 0.15: IC1.N4 12.1,42 12.1,41.99 v12.07,41.97
  InnerTop 0.2: JP2.27 24.9,25.69 24.9,24.4 22.6,22.1 6.22,22.1 5.2,23.12 5.2,24.9 v5.35,25.05
  Bottom 0.2: v5.35,25.05 5.85,25.55 5.85,27.78 6.45,28.38 6.45,30.15 8,31.7 8,39.95 9.5,41.45 11.55,41.45 v12.07,41.97
DAC2  (via drill 0.2)
  Top 0.13: IC1.P4 10.78,41.33 8.92,41.33
  Top 0.15: 8.92,41.33 v8.8,41.45
  InnerTop 0.2: JP2.28 27.65,25.9 25.85,25.9 25.25,25.3 25.25,24.3 22.7,21.75 6.15,21.75 4.9,23 4.9,25.35 5.2,25.65 v5.2,25.7
  Bottom 0.2: v5.2,25.7 5.23,25.7 5.55,26.02 5.55,27.9 6.12,28.48 6.12,30.27 7.7,31.85 7.7,40.35 v8.8,41.45
EXTI0  (via drill 0.2)
  Top 0.13: IC1.N3 11.43,42.62 11.43,46.42
  Top 0.15: 11.43,46.42 v11.35,46.5
  Bottom 0.15: JP1.10 4.9,48.75 4.9,48.09 6.5,46.5 v11.35,46.5
EXTI2  (via drill 0.2)
  Top 0.15: IC1.D12 17.2,36.85 17.2,37.49 v16.62,38.07
  InnerTop 0.15: v16.62,38.07 16.62,39.97 17.1,40.45 19.1,40.45 19.75,41.1 19.75,46.6 18.6,47.75 v15.9,47.75
  Bottom 0.15: v15.9,47.75 12.4,47.75 11.95,48.2 6.9,48.2 6.3,48.8 6.3,54.55 4.35,56.5 2.23,56.5 JP1.3
EXTI3  (via drill 0.2)
  Top 0.15: IC1.R2 9.85,43.55 v9.85,44.4
  Bottom 0.15: JP1.14 4.27,44.3 6.3,44.3 6.8,44.8 9.45,44.8 v9.85,44.4
EXTI4  (via drill 0.2)
  Top 0.15: IC1.H4 15.45,41.2 v15.5,41.2
  Bottom 0.15: JP1.11 2.32,46.25 3.96,46.25 4.91,45.3 9.55,45.3 10.55,44.3 11.61,44.3 12.81,43.1 14.84,43.1 15.1,42.84 15.1,41.6 v15.5,41.2
EXTI7  (via drill 0.2)
  Top 0.15: IC1.R3 9.6,42.3 9.1,42.8 v9.1,44.4
  Bottom 0.15: v9.1,44.4 6.8,44.4 6.4,44 2.03,44 JP1.13
EXTI8  (via drill 0.2)
  Top 0.15: IC1.G14 v15.97,35.47
  InnerTop 0.15: v15.97,35.47 15.97,37.22 16.15,37.4 16.15,39.85 17,40.7 18.95,40.7 19.5,41.25 19.5,46.4 19.35,46.55 18.55,47.35 v16.3,47.35
  Bottom 0.15: v16.3,47.35 12.3,47.35 11.85,47.8 6.9,47.8 6,48.7 6,52.73 JP1.6
EXTI9  (via drill 0.2)
  Top 0.15: IC1.F14 v15.97,34.82
  InnerTop 0.15: v15.97,34.82 15.55,35.24 15.55,36.47 15.7,36.62 15.7,37.3 15.9,37.5 15.9,39.95 16.9,40.95 18.85,40.95 19.25,41.35 19.25,46.2 18.52,46.93 v15.9,46.93
  Bottom 0.15: JP1.5 2.29,53.9 4.2,53.9 5.7,52.4 5.7,48.55 6.75,47.5 11.75,47.5 12.32,46.93 v15.9,46.93
EXTI10  (via drill 0.2)
  Top 0.15: IC1.B10 v19.23,37.42
  InnerTop 0.15: v19.23,37.42 20,38.19 20,46.8 18.65,48.15 v16.3,48.15
  Bottom 0.15: v16.3,48.15 12.5,48.15 12.15,48.5 7.05,48.5 6.6,48.95 6.6,54.67 JP1.4
EXTI11  (via drill 0.2)
  Top 0.15: IC1.E4 v16.6,41.3
  InnerTop 0.15: v16.6,41.3 17.25,41.3 17.7,41.75 18.45,41.75 19,42.3 19,45.95 18.4,46.55 v16.3,46.55
  Bottom 0.15: JP1.8 5.4,50.79 5.4,48.4 6.55,47.25 11.6,47.25 12.3,46.55 v16.3,46.55
EXTI13  (via drill 0.2)
  Top 0.15: v17.5,44.7 17.5,44.25 17.6,44.15 IC1.D1
  Bottom 0.15: JP1.7 2.35,51.3 4.25,51.3 5.15,50.4 5.15,48.25 6.45,46.95 11.5,46.95 12.35,46.1 15.95,46.1 16.95,45.1 17.1,45.1 v17.5,44.7
EXTI14  (via drill 0.2)
  Top 0.15: v16.95,44.7 IC1.E1
  Bottom 0.15: JP1.9 2.31,48.8 3.95,48.8 4.65,48.1 4.65,47.85 6.7,45.8 15.85,45.8 v16.95,44.7
EXTI15  (via drill 0.2)
  Top 0.15: v15.85,44.45 16.3,44 IC1.F1
  Bottom 0.15: JP1.12 5.56,45.55 14.75,45.55 v15.85,44.45
FLASH_CLK  (via drill 0.2)
  Top 0.15: IC9.6 17.63,52.09 v17.65,52.1 | v12.6,44.7 12.6,44.35 13.05,43.9 IC1.L1
  InnerTop 0.15: v12.6,44.7 12.6,48.9 15.8,52.1 v17.65,52.1
FLASH_DQ0  (via drill 0.2)
  Top 0.13: IC1.L3 13.38,42.63 13.38,44.15
  Top 0.15: IC9.5 17.84,53.35 18.05,53.15 v18.05,51.65 | 13.38,44.15 v13.08,44.46
  InnerTop 0.15: v13.08,44.46 13.08,48.93 15.8,51.65 v18.05,51.65
FLASH_DQ1  (via drill 0.2)
  Top 0.13: IC1.L2 12.72,43.28 12.72,43.78
  Top 0.15: IC9.2 21.52,50.81 v21.5,50.8 | 12.72,43.78 12.15,44.35 v12.15,44.45
  InnerTop 0.15: v12.15,44.45 12.15,48.9 15.85,52.6 19.7,52.6 v21.5,50.8
FLASH_DQ2  (via drill 0.2)
  Top 0.15: IC9.3 21.52,52.09 v21.5,52.1 | v21.85,43.5 20.1,43.5 IC1.A2
  InnerTop 0.15: v21.5,52.1 22.05,51.55 22.05,43.7 v21.85,43.5
FLASH_DQ3  (via drill 0.2)
  Top 0.13: IC1.K2 14.03,43.28 14.03,43.83
  Top 0.15: IC9.7 16.34,50.85 v17.65,50.85 | v14.25,44.7 14.25,44.05 14.03,43.83
  InnerTop 0.15: v14.25,44.7 14.25,45.15 13.8,45.6 13.8,49.2 15.45,50.85 v17.65,50.85
FLASH_NCS  (via drill 0.2)
  Top 0.15: IC9.1 23.11,48.85 v23.05,48.85 | IC1.J15 14.05,34.2 14.05,33.12 v13.64,32.71
  InnerTop 0.15: v23.05,48.85 22.8,48.6 22.8,35 24.56,33.24 25,33.24 v25.3,32.94
  Bottom 0.15: v25.3,32.94 24.99,33.25 17.1,33.25 16.55,32.7 v13.65,32.7 v13.64,32.71
GND  (via drill 0.2)
  Top 0.15: IC2.P8 9.8,25.1 7.55,25.1 C2.2 | IC1.F2 v16,43.25 15.95,43.25 IC1.G2 | IC1.J7 v14.67,39.38 IC1.H8 | IC1.H8 v15.32,38.72 v15.33,38.72 IC1.G9 | IC1.G7 v15.33,39.38 IC1.H8 | IC1.J9 v14.67,38.72 IC1.H8 | IC2.B8 19.4,25.1 19.4,24.35 | IC2.N1 10.95,31.1 10.6,30.75 10.6,29.9 IC2.P3 IC2.R3 | IC1.L4 13.1,41.6 13.1,40.8 13.55,40.35 IC1.K6 | C10.2 11.3,32.45 11.52,32.23 11.52,31.5 v11.42,31.4 | IC2.L3 v12.6,28.8 | IC2.L9 12.1,24.2 C3.2 | 21.4,29.5 IC2.A3 IC2.B3 v19.4,29.9 18.59,29.9 | IC1.D9 17.38,38.4 v17.06,38.72 v17.05,38.72 17.38,39.05 IC1.D8 | IC1.H12 v15.3,36.75 15.6,36.45 IC1.G12 15.7,36.5 16.25,36.5 IC1.F12 | 18.59,29.9 18.59,31.1 IC2.C1 | 18.59,29.9 v18.59,29.01 v18.6,29 | IC1.D5 16.95,41 IC1.F6 | v2.95,38.9 3.2,38.65 C40.2 | C20.2 17.28,32.6 17.38,32.51 17.38,31.83 16.65,31.1 IC2.F1 | IC1.M8 v12.71,38.74
  Top 0.254: v5.8,23.95 5.8,23.3 L1.2 6,23.2 6,22.9 v6.65,22.9 | CN1.G3 16.52,56.9 16.45,56.98 CN1.5
  Top 0.305: C39.2 12.61,50.17 12.4,49.96 12.4,49.94 U3.1 v10.71,49.86
  Bottom 0.2: v8.52,39.35 8.52,39.92 9.55,40.95 11.36,40.95 12.41,39.9 12.9,39.9 13.15,39.65 13.15,39.18 v12.71,38.74
  other vias: 12.92,23.03 9.18,52.15 8.63,57.35 8.63,56.2 19.45,31.55 18.35,54.65 25.3,36.45 25.05,38.45 25,40.65 25.05,42.9 7.12,40.8 4.25,36.5 21.45,44.45 15.85,28 19.3,27.7 25.05,31.6 25.15,45 21.2,47.55 19.85,51.5 21.25,57.2 2.28,58.95 4.93,54.85 10.05,23.15 22.25,22.6 4.15,33.8 17.65,27.95
  pour Top: -0.2,62 30,62 30,31.2 25.8,31.2 24.7,30.1 24.7,24.72 22.41,22.39 6.21,22.46 5.3,23.39 5.3,30.16 4.18,31.24 -0.24,31.27
  pour Bottom: -0.2,62 30,62 30,31.2 25.8,31.2 24.7,30.1 24.7,24.72 22.41,22.39 6.22,22.46 5.3,23.4 5.3,30.16 4.18,31.24 -0.24,31.27
  pour InnerBottom: -0.2,62 30,62 30,31.2 25.8,31.2 24.7,30.1 24.7,24.72 22.41,22.39 6.22,22.46 5.3,23.4 5.3,30.16 4.18,31.24 -0.24,31.27
I2C_SCL  (via drill 0.2)
  Top 0.15: IC1.A5 20.95,41 21.65,41.7 v25.05,41.7
  InnerTop 0.15: v25.05,41.7 25.3,41.7 25.8,41.2 27.3,41.2 27.7,40.8 27.7,33.57 JP2.23
I2C_SDA  (via drill 0.2)
  Top 0.13: IC1.B5 19.23,41.33 20.93,41.33
  Top 0.15: 20.93,41.33 21.55,41.95 24.7,41.95 v25.05,42.3
  InnerTop 0.15: JP2.24 27.95,33.32 27.95,40.95 27.45,41.45 25.9,41.45 v25.05,42.3
LPTIM1_CH1  (via drill 0.2)
  Top 0.15: IC1.B8 v19.22,38.73 | JP1.17 2.07,40.96 2.07,43.37 2.35,43.65 2.35,48.05 3.1,48.8 7.05,48.8 7.21,48.96 v7.24,48.96
  Bottom 0.15: v19.22,38.73 19.29,38.8 24.3,38.8 25.4,39.9 25.4,40.3 26.3,41.2 26.9,41.2 27.6,41.9 27.6,45.7 27.1,46.2 19,46.2 16.25,48.95 7.28,48.95 7.27,48.96 v7.24,48.96
LPTIM1_CH2  (via drill 0.2)
  Top 0.13: IC1.B9 19.23,38.07 19.74,38.07
  Top 0.15: v21.45,38.38 20.05,38.38 19.74,38.07 | JP1.18 3.57,40.97 4.9,42.3 4.9,43.65 v6.15,44.9
  InnerBottom 0.15: v7.23,49.62 6.43,49.62 6.15,49.33 v6.15,44.9
  Bottom 0.15: v21.45,38.38 21.57,38.5 24.4,38.5 24.8,38.9 27.15,38.9 27.7,39.45 27.7,41.6 27.85,41.75 27.85,45.85 27.25,46.45 19.1,46.45 16.3,49.25 7.6,49.25 v7.23,49.62
N$1  (via drill 0.2)
  Top 0.15: C14.1 7.91,37.6 v8.5,37.6 | IC1.M10 v12.08,37.43 v12.07,37.43
  Bottom 0.2: v8.5,37.6 10.92,37.6 11.16,37.84 11.66,37.84 v12.07,37.43
N$2
  Top 0.254: IC3.24 17.43,10.92 19.13,10.92 19.89,10.16 C28.-
N$3
  Top 0.254: IC3.10 10.11,16.11 C18.1 9.97,17.77 8.94,16.74 C31.+
N$4
  Top 0.254: IC3.19 12.04,9.61 C35.1
N$5
  Top 0.254: IC3.22 16.21,10.73 C32.1
N$6
  Top 0.15: IC3.37 16.67,17.78 18.11,17.78 | 18.11,17.78 18.5,17.4 R6.2 | IC3.38 16.47,18.29 17.61,18.29 | 17.61,18.29 18.11,17.78 | IC3.39 16.27,18.8 17.1,18.8 17.61,18.29
N$11
  Top 0.13: IC1.F13 16.63,35.47 16.63,34.02
  Top 0.152: 16.63,34.02 18,32.65 18.55,32.65 C13.1
N$12
  Top 0.15: 14.35,46.24 15.66,46.24 16,45.9 16,45.6 15.2,44.8 15.2,43.8 IC1.H1
  Top 0.2: Y1.1 14.35,46.24 14.5,46.24 13.87,45.62 C23.1
N$15
  Top 0.15: Y1.2 16.94,46.24 16.45,45.75 16.45,45.65 15.45,44.65 15.45,43.8 IC1.G1
  Top 0.2: Y1.2 18.3,46.24 18.97,45.58 C22.1
NRST  (via drill 0.2)
  Top 0.15: v14.8,44.7 14.6,44.5 14.6,43.85 IC1.J1 | C26.1 v21.7,54.55 19.04,54.55 18.45,53.95 18.45,50.8 v18.1,50.45
  InnerTop 0.15: v14.8,44.7 14.8,45.05 14.15,45.7 14.15,49.15 15.45,50.45 v18.1,50.45
  Bottom 0.2: J1.10 22.96,54.55 v21.7,54.55
PDR_ON  (via drill 0.2)
  Top 0.152: IC1.C6 v17.95,40.05
  Bottom 0.15: BOOT1.2 21.45,39.3 20.7,40.05 v17.95,40.05
RAM_!CAS  (via drill 0.2)
  Top 0.13: v20.7,39.4 20.67,39.37 19.23,39.37 IC1.B7
  Top 0.15: IC2.K7 v13.8,25.9
  InnerTop 0.15: v20.7,39.4 20.7,39.05 20.55,38.9 20.55,37.76 20.05,37.26 20.05,36.94 20.17,36.82 20.17,35.58 23.65,32.1 23.65,26.25 20.9,23.5 14.75,23.5 14.18,24.07 14.18,24.51 13.8,24.88 v13.8,25.9
RAM_!CS  (via drill 0.2)
  Top 0.15: IC2.J8 13.8,25.1 v13.8,24.3 | v15.97,41.97 IC1.G4
  InnerTop 0.15: v20.42,37.1 20.42,35.72 23.9,32.24 23.9,26.15 21,23.25 14.6,23.25 13.8,24.05 v13.8,24.3
  InnerBottom 0.15: v15.97,41.97 14.85,43.09 14.85,43.55 15.18,43.88 19.22,43.88 19.8,43.3 19.8,41.8 20.25,41.35 20.25,37.27 v20.42,37.1
RAM_!RAS  (via drill 0.2)
  Top 0.15: IC2.J9 v14.6,24.3 | IC1.R6 10.42,40.32 9.25,40.32 9.05,40.12 v9.05,39.52
  InnerBottom 0.15: v8.6,25.5 8.45,25.65 8.45,30.7 9.15,31.4 9.15,36.05 8.9,36.3 8.9,39.27 9.05,39.42 v9.05,39.52
  Bottom 0.15: v14.6,24.3 14.09,23.79 10.86,23.79 9.15,25.5 v8.6,25.5 | v8.6,25.5
RAM_!WE  (via drill 0.2)
  Top 0.15: IC2.K8 v13,25.9 | IC1.J4 13.9,41.2 13.65,41.2 v13.5,41.05
  InnerTop 0.15: v9.7,26.7 10.2,27.2 10.2,32.85 10.1,32.95 10.1,37.07 10.69,37.66 10.96,37.66 11.6,38.3 13.05,38.3 13.25,38.5 13.25,40.8 v13.5,41.05
  Bottom 0.15: v13,25.9 12.62,25.52 11.24,25.52 11.22,25.55 10.85,25.55 v9.7,26.7
RAM_A0  (via drill 0.2)
  Top 0.13: IC1.E2 16.63,43.27 16.63,44.44
  Top 0.15: IC2.G8 v15.4,25.1 | 16.63,44.44 16.57,44.49 16.57,44.5 v16.35,44.72
  InnerBottom 0.15: v15.4,25.1 15.78,24.72 15.78,24.24 16.07,23.95 18.3,23.95 23.65,29.3 23.65,33.2 20.8,36.05 20.8,38.5 21.1,38.8 21.1,40.85 20.05,41.9 20.05,43.4 19.15,44.3 16.75,44.3 16.35,44.7 v16.35,44.72
RAM_A1  (via drill 0.2)
  Top 0.13: v15.33,43.28 15.33,42.63 IC1.H3
  Top 0.15: v16.2,24.35 15.85,24.7 IC2.G9
  InnerBottom 0.15: v16.2,24.35 18.35,24.35 22.8,28.8 22.8,33.7 20,36.5 20,41.2 19.55,41.65 19.55,43.19 19.12,43.63 15.67,43.63 v15.33,43.28
RAM_A2  (via drill 0.2)
  Top 0.15: IC2.F7 v16.6,26.8 | IC1.H2 v14.7,42.65
  InnerTop 0.15: v16.6,26.8 16.6,28.75 15.8,29.55 15.8,31.65 14.55,32.9 14.55,34.74 14.92,35.11 14.92,35.88 14,36.8 14,39.85 14.8,40.65 14.8,42.55 v14.7,42.65
RAM_A3  (via drill 0.2)
  Top 0.15: IC2.F3 v16.2,29.9 | IC1.J2 v14.04,42.65
  InnerBottom 0.15: v16.2,29.9 16.2,29.93 15.81,30.33 15.28,30.33 14.8,30.8 14.8,32.73 15.37,33.3 15.37,34.28 14.67,34.98 14.67,35.95 13.25,37.37 13.25,40.65 13.1,40.8 13.1,41.25 13.3,41.45 14.15,41.45 14.4,41.7 14.4,42.29 v14.04,42.65
RAM_A4  (via drill 0.2)
  Top 0.13: IC1.J3 14.68,41.97 14.68,41.43 v14.4,41.15
  Top 0.15: IC2.G1 v15.4,31.5
  InnerTop 0.15: v15.4,31.5 15.35,31.5 14.3,32.55 14.3,34.86 14.66,35.22 14.66,35.74 13.75,36.65 13.75,39.95 14.4,40.6 v14.4,41.15
RAM_A5  (via drill 0.2)
  Top 0.15: IC1.K3 v13.38,41.98 | IC2.G2 16.2,30.7 v16.2,31.5
  InnerTop 0.15: v16.2,31.5 16.05,31.65 16.05,31.75 15.3,32.5 15.3,33.66 15.3,35.85 14.25,36.9 14.25,39.74 15.1,40.59 15.1,42.8 14.8,43.1 13.65,43.1 13.38,42.83 v13.38,41.98
RAM_A6  (via drill 0.2)
  Top 0.15: v11.43,40.02 IC1.P6 | IC2.G3 15.45,29.15 v15.4,29.15
  InnerTop 0.15: v11.43,40.02 10.37,38.97 10.37,37.69 9.85,37.17 9.85,32.84 9.95,32.74 9.95,30.58 9.42,30.06 9.42,29.34 9.72,29.05 v9.75,29.05
  Bottom 0.15: v9.75,29.05 10.4,28.4 13.25,28.4 14.38,29.53 15.02,29.53 v15.4,29.15
RAM_A7  (via drill 0.2)
  Top 0.13: 12.58,40.03 12.07,40.03
  Top 0.15: v12.85,40.3 12.58,40.03 | IC1.N6 12.07,40.03 | v15.4,30.75 15.05,31.1 IC2.H1
  InnerTop 0.15: v12.85,40.3 v12.84,40.3 12.24,40.9 8.69,40.9 7.55,39.76 7.55,28.2 v8.9,26.85
  Bottom 0.15: v15.4,30.75 15.8,30.35 15.8,28.95 14.35,27.5 13.71,27.5 13.44,27.77 9.49,27.77 9.3,27.58 9.3,27.25 v8.9,26.85
RAM_A8  (via drill 0.2)
  Top 0.15: v15.35,29.9 15,30.25 IC2.H2
  Top 0.152: IC1.R7 10.45,39.75 10.3,39.9 v9.45,39.9
  InnerBottom 0.15: v9.45,39.9 10.37,39.9 14.42,35.85 14.42,34.88 14.55,34.75 14.55,30.7 v15.35,29.9
RAM_A9  (via drill 0.2)
  Top 0.15: IC1.P7 v10.79,40.01 | IC2.J3 14.55,29.15 v14.58,29.15
  InnerTop 0.15: v10.79,40.01 10.79,40 10.12,39.33 10.12,37.82 9.6,37.3 9.6,30.59 9.15,30.14 9.15,28.88 9.28,28.76 9.28,28.62 v9.75,28.15
  Bottom 0.15: v9.75,28.15 13.58,28.15 v14.58,29.15
RAM_A10  (via drill 0.2)
  Top 0.15: IC1.N7 v12.07,39.38 | v15.8,26.8 IC2.G7
  InnerTop 0.15: v12.07,39.38 12.07,39.97 11.64,40.4 8.9,40.4 8.1,39.6 8.1,39.59 8.1,38.35 8.35,38.1 8.8,38.1 9.35,37.55 9.35,31.6 8.5,30.75 8.5,28.4 9.55,27.35 v9.75,27.35
  Bottom 0.15: v15.8,26.8 15.35,26.35 10.75,26.35 v9.75,27.35
RAM_A11  (via drill 0.2)
  Top 0.15: IC2.H9 v14.6,25.1 | v12.69,39.4 IC1.M7
  InnerTop 0.15: v12.69,39.4 12.69,39.78 11.83,40.65 8.8,40.65 7.8,39.65 7.8,28.5 v8.9,27.4
  Bottom 0.15: v8.9,27.4 8.45,26.95 8.45,26.15 8.7,25.9 9.25,25.9 10.45,24.7 14.2,24.7 v14.6,25.1
RAM_A12  (via drill 0.2)
  Top 0.15: IC2.H3 15,29 v13.9,27.9 | IC1.L15 13.05,33.85 v12.8,33.6
  InnerBottom 0.15: v13.9,27.9 13.45,28.35 13.45,31.45 12.8,32.1 v12.8,33.6
RAM_BA0
  Top 0.13: IC1.K14 13.38,34.83 13.38,33.73
  Top 0.15: 13.38,33.73 13.25,33.6 13.25,32.3 13.8,31.75 13.8,28.39 13.5,28.09 13.5,27.73 14.18,27.06 14.18,26.32 IC2.J7
RAM_BA1  (via drill 0.2)
  Top 0.15: IC2.H8 14.6,25.9 14.6,26.5 v14.95,26.85
  Top 0.152: v13.38,35.47 13.38,35.49 IC1.K13
  InnerBottom 0.15: v14.95,26.85 14.95,28.15 14.2,28.9 14.2,31 14.3,31.1 14.3,34.55 v13.38,35.47
RAM_CLK
  Top 0.13: IC1.H14 14.68,34.83 14.68,34.28
  Top 0.15: 14.68,34.28 14.35,33.95 14.35,31.25 IC2.J1
RAM_CLKE  (via drill 0.2)
  Top 0.15: IC2.J2 v14.6,29.9 | IC1.F4 15.9,41.25 15.9,41 15.66,40.76 v13.94,40.76
  InnerTop 0.15: v14.6,29.9 14.6,31.85 14.05,32.4 14.05,34.96 14.41,35.32 14.41,35.64 13.5,36.55 13.5,40.3 v13.95,40.75 v13.94,40.76
RAM_D0  (via drill 0.2)
  Top 0.15: IC1.M14 v12.09,34.84 v12.08,34.84 | v11.13,27.22 11.13,27.18 10.6,26.65 10.6,26.05 10.41,25.86 9.76,25.86 IC2.R8
  InnerBottom 0.15: v12.08,34.84 11.42,34.18 11.42,32.38 12.08,31.72 12.08,29.23 11.13,28.28 v11.13,27.22
RAM_D1  (via drill 0.2)
  Top 0.13: IC1.L14 12.72,34.82 12.72,34.12
  Top 0.15: 12.72,34.12 12.3,33.7 v12.3,33.4 | IC2.N7 11,26.5 v11.7,27.2
  InnerBottom 0.15: v11.7,27.2 11.7,28.45 12.35,29.1 12.35,31.85 12.3,31.9 v12.3,33.4
RAM_D2  (via drill 0.2)
  Top 0.15: IC2.R9 v10.07,24.03 | IC1.B12 v19.22,36.77
  InnerTop 0.15: v19.22,36.77 19.22,34.82 18.84,34.44 18.84,34.01 19.06,33.79 20.9,33.79 22.55,32.14 22.55,25.5 20.94,23.9 v15.1,23.9
  Bottom 0.15: v10.07,24.03 10.64,23.46 14.66,23.46 v15.1,23.9
RAM_D3  (via drill 0.2)
  Top 0.15: IC2.N8 v11.4,25.1 | IC1.C12 v18.57,36.77
  InnerTop 0.15: v18.57,36.77 18.95,36.39 18.95,34.9 18.59,34.54 18.59,33.91 18.96,33.54 20.8,33.54 22.3,32.04 22.3,25.61 20.84,24.15 17.1,24.15 16.5,24.75 15.8,24.75 v15.4,24.35
  Bottom 0.15: v11.4,25.1 13.2,25.1 13.6,25.5 14.8,25.5 15,25.3 15,24.75 v15.4,24.35
RAM_D4  (via drill 0.2)
  Top 0.15: IC2.P9 v10.6,25.1 | IC1.R8 v9.3,39.05
  InnerBottom 0.15: v10.6,25.1 9.6,25.1 9.25,25.45 9.3,25.5 9.3,30.05 9.4,30.15 9.4,36.15 9.15,36.4 9.15,38.9 v9.3,39.05
RAM_D5  (via drill 0.2)
  Top 0.13: IC1.P8 10.78,39.37 9.83,39.37
  Top 0.15: 9.83,39.37 v9.75,39.45 | IC2.M8 v11.4,25.9
  InnerBottom 0.15: v11.4,25.9 10.68,25.9 10.43,26.15 10.43,30.18 9.9,30.7 9.9,36.45 9.71,36.64 9.71,38.16 9.93,38.39 9.93,38.92 9.75,39.1 v9.75,39.45
RAM_D6  (via drill 0.2)
  Top 0.15: IC1.P9 v10.78,38.72 | IC2.M7 11.8,26.45 v12.1,26.75
  InnerBottom 0.15: v12.1,26.75 11,26.75 10.7,27.05 10.7,30.26 10.15,30.81 10.15,36.55 9.96,36.75 9.96,37.9 v10.78,38.72
RAM_D7  (via drill 0.2)
  Top 0.15: IC2.L8 v12.2,25.9 | IC1.R9 9.75,38.4 v9.56,38.59
  InnerBottom 0.15: v9.56,38.59 9.46,38.49 9.46,36.49 9.65,36.3 9.65,30.6 10.18,30.07 10.18,26.02 10.68,25.52 11.82,25.52 v12.2,25.9
RAM_D8  (via drill 0.2)
  Top 0.15: IC2.L2 12.2,29.9 12.2,29.25 11.75,28.8 v11.1,28.8 | IC1.P10 v11.42,37.43
  InnerTop 0.15: v11.42,37.43 11.39,37.4 10.8,37.4 10.35,36.95 10.35,33.05 10.45,32.95 10.45,29.45 v11.1,28.8
RAM_D9  (via drill 0.2)
  Top 0.15: IC2.M3 11.5,29.2 v11.45,29.2 | IC1.R10 v10.78,38.07
  InnerBottom 0.15: v10.78,38.07 10.22,37.51 10.22,36.83 10.4,36.66 10.4,30.95 11,30.35 11,29.65 v11.45,29.2
RAM_D10  (via drill 0.2)
  Top 0.15: IC2.M2 v11.4,29.9
  Top 0.152: v12.06,36.79 IC1.N11
  InnerBottom 0.15: v11.4,29.9 IC2.M2 11.8,31.6 11.15,32.25 11.15,35.2 12.06,36.11 v12.06,36.79
RAM_D11  (via drill 0.2)
  Top 0.15: v11.05,31.75 10.85,31.75 IC2.P1 | v11.42,36.78 IC1.P11
  InnerBottom 0.15: v11.05,31.75 10.9,31.9 10.9,36.26 v11.42,36.78
RAM_D12  (via drill 0.2)
  Top 0.15: IC2.N2 v11.35,30.65 | IC1.R11 v10.76,36.79
  InnerBottom 0.15: v10.76,36.79 10.76,36.51 10.65,36.4 10.65,31.1 11.1,30.65 v11.35,30.65
RAM_D13
  Top 0.15: IC1.P15 11.1,34.3 10.2,33.4 10.2,33.05 9.4,32.25 IC2.R1
RAM_D14  (via drill 0.2)
  Top 0.13: IC1.P14 10.77,34.82 10.77,34.37 9.95,33.55
  Top 0.15: IC2.N3 10.1,28.6 v8.9,28.6 | 9.95,33.55 9.95,33.2 8.9,32.15 v8.9,30.55
  InnerBottom 0.15: v8.9,30.55 v8.9,28.6
RAM_D15
  Top 0.15: IC2.R2 9.8,30.7 9.8,32.25 10.45,32.9 10.45,33.25 11.7,34.5 IC1.N15
RAM_D16  (via drill 0.2)
  Top 0.15: IC1.M12 v12.75,36.8 | IC2.E8 17,25.9 v17,27.2
  InnerTop 0.15: v12.45,27.25 12.45,28.35 11.82,28.98 11.82,31.53 10.7,32.66 10.7,33.05 10.6,33.15 10.6,34.65 v12.75,36.8
  Bottom 0.15: v12.45,27.25 12.47,27.23 16.97,27.23 v17,27.2
RAM_D17  (via drill 0.2)
  Top 0.15: IC2.D7 v18.2,26.85
  Top 0.152: IC1.M13 v12.08,35.48
  InnerBottom 0.15: v12.08,35.48 13.25,34.31 13.25,32.05 13.7,31.6 13.7,28.65 14.3,28.05 14.3,26.55 14.77,26.07 17.45,26.07 18.2,26.82 v18.2,26.85
RAM_D18  (via drill 0.2)
  Top 0.15: IC2.D8 17.8,25.9 17.8,26.58 v17.53,26.85
  Top 0.152: IC1.L13 v12.73,35.48
  InnerBottom 0.15: v12.73,35.48 14.05,34.16 14.05,31.2 13.95,31.1 13.95,28.8 14.55,28.2 14.55,26.65 14.88,26.32 17.01,26.32 v17.53,26.84 v17.53,26.85
RAM_D19  (via drill 0.2)
  Top 0.15: v16.4,36.95 15.95,37.4 14,37.4 IC1.L12 | IC2.B9 v20.2,25.1
  InnerTop 0.15: v20.2,25.1 20.1,25.2 20.1,31.64 19.74,32 18.34,32 16.39,33.95 v16.39,36.94 v16.4,36.95
RAM_D20  (via drill 0.2)
  Top 0.15: IC2.C8 v18.65,25.85 | IC1.K12 14.25,37 v14.7,37
  InnerBottom 0.15: v18.65,25.85 18.65,28.4 16.6,30.45 16.6,31.03 17.38,31.82 17.38,33.05 16.06,34.38 15.67,34.38 14.92,35.13 14.92,36.18 14.7,36.4 v14.7,37
RAM_D21  (via drill 0.2)
  Top 0.15: v16.69,37.4 16.85,37.24 16.85,36.55 IC1.E12 | v21.1,25.55 21.1,25.2 IC2.A9
  InnerTop 0.15: v21.1,25.55 20.35,26.3 20.35,31.75 19.85,32.25 18.45,32.25 16.64,34.06 16.64,36.62 16.81,36.79 16.8,36.8 16.8,37.29 v16.69,37.4
RAM_D22  (via drill 0.2)
  Top 0.13: v18.57,36.13 v18.56,36.12 17.27,36.12 IC1.E13
  Top 0.15: IC2.C7 19,26.31 v19.32,26.63
  InnerBottom 0.15: v18.57,36.13 19.57,36.13 22.3,33.4 22.3,29.06 19.87,26.63 v19.32,26.63
RAM_D23  (via drill 0.2)
  Top 0.15: IC1.D13 v17.27,35.47 | IC2.A8 20.6,25.6 21.1,26.1 v21.1,26.12
  InnerTop 0.15: v21.1,26.12 20.6,26.62 20.6,31.85 19.95,32.5 18.55,32.5 16.89,34.16 16.89,35.09 v17.27,35.47
RAM_D24  (via drill 0.2)
  Top 0.15: IC2.A2 v21,30.3 | v17.28,34.83 IC1.E14
  InnerTop 0.15: v21,30.3 21,31.88 20.13,32.75 18.68,32.75 17.28,34.15 v17.28,34.83
RAM_D25  (via drill 0.2)
  Top 0.15: v21,29.1 19.4,29.1 IC2.C3 | v17.92,34.83 IC1.D14
  InnerTop 0.15: v17.92,34.83 18.09,34.66 18.09,33.69 18.78,33 20.23,33 21.5,31.73 21.5,30.15 21,29.65 v21,29.1
RAM_D26  (via drill 0.2)
  Top 0.13: v19.23,34.17 18.73,34.17 18.57,34.33 18.57,34.83
  Top 0.15: v23.25,31 23,31 22.9,31.1 IC2.A1 | IC1.C14 18.57,34.83
  InnerTop 0.15: v19.23,34.17 20.87,34.17 22.8,32.25 22.8,31.24 23.04,31 v23.25,31
RAM_D27  (via drill 0.2)
  Top 0.15: v21.9,30.65 21.85,30.7 19.4,30.7 IC2.C2 | v18.57,35.47 IC1.C13
  InnerTop 0.15: v18.57,35.47 18.57,34.88 18.34,34.65 18.34,33.8 18.85,33.29 20.69,33.29 21.9,32.08 v21.9,30.65
RAM_D28  (via drill 0.2)
  Top 0.13: 20.45,41.98 18.76,41.98 18.44,42.3 IC1.C3
  Top 0.15: v20.45,42.05 20.45,41.98 | IC2.B1 20.25,31.55 v23.25,31.55
  InnerTop 0.15: v20.45,42.05 20.45,39.75 20.3,39.6 20.3,37.86 19.8,37.36 19.8,36.84 19.92,36.71 19.92,35.47 23.25,32.15 v23.25,31.55
RAM_D29  (via drill 0.2)
  Top 0.15: v17.8,30.7 IC2.D2 | IC1.C2 v17.95,42.65
  InnerBottom 0.15: v17.8,30.7 18.75,31.65 18.75,33.45 18.38,33.82 17.34,33.82 16.6,34.57 16.6,35.7 17.45,36.55 17.45,37.05 17.76,37.36 17.76,38.94 17.28,39.42 17.28,41.33 17.95,42 v17.95,42.65
RAM_D30  (via drill 0.2)
  Top 0.13: IC1.D3 17.92,41.98 18.37,41.98 18.58,41.77 v18.58,41.33
  Top 0.15: v19.6,28.5 18.45,28.5 18.2,28.75 IC2.D3
  InnerBottom 0.13: 18.45,34.95 17.95,35.45
  InnerBottom 0.15: v19.6,28.5 20.6,29.5 20.6,34.55 20.2,34.95 18.45,34.95 | 17.95,35.45 17.95,36.8 18.28,37.13 18.28,39.13 18.12,39.28 18.12,39.57 18.58,40.03 v18.58,41.33
RAM_D31  (via drill 0.2)
  Top 0.15: IC2.E2 v17,30.7 | v16.65,42 IC1.E3
  InnerBottom 0.15: v17,30.7 17.42,31.12 17.87,31.12 18.5,31.75 18.5,33.3 18.23,33.57 17.23,33.57 16.35,34.45 16.35,35.85 17.2,36.7 17.2,37.21 17.51,37.52 17.51,38.83 17,39.34 17,41.6 16.65,41.95 v16.65,42
RAM_M0  (via drill 0.2)
  Top 0.15: IC2.K9 v13,24.3
  Top 0.152: IC1.A4 20.7,41.65 v21.35,42.3
  InnerTop 0.15: v21.35,42.3 21.35,38.9 21.05,38.6 21.05,35.8 24.4,32.45 24.4,25.9 21.25,22.75 14.38,22.75 13,24.13 v13,24.3
RAM_M1  (via drill 0.2)
  Top 0.15: v13.4,26.85 13,27.25 13,30.7 IC2.K1
  Top 0.152: IC1.A3 20.1,42.3 20.25,42.45 20.8,42.45 v20.85,42.5
  InnerTop 0.15: v20.85,42.5 20.85,39.9 21.1,39.65 21.1,39.05 20.8,38.75 20.8,35.7 24.15,32.35 24.15,26 21.15,23 14.49,23 14.21,23.28 14.21,23.29 13.42,24.07 13.42,24.68 13.4,24.7 v13.4,26.85
RAM_M2  (via drill 0.2)
  Top 0.13: IC1.D4 v17.27,41.98
  Top 0.15: IC2.F8 v16.25,25.15
  InnerBottom 0.15: v16.25,25.15 16.7,24.7 18.33,24.7 22.55,28.92 22.55,33.55 19.73,36.37 19.73,41.12 19.3,41.55 19.3,43 18.95,43.35 17.7,43.35 17.27,42.92 v17.27,41.98
RAM_M3  (via drill 0.2)
  Top 0.13: 18.25,41.6 17.98,41.33
  Top 0.15: v17.8,29.95 17.75,29.9 17.05,29.9 16.65,30.3 IC2.F2 | v17.92,41.33 17.98,41.33 | 18.25,41.6 IC1.C4
  InnerBottom 0.15: v17.8,29.95 19,31.15 19,33.55 18.48,34.07 17.45,34.07 16.85,34.67 16.85,35.6 17.7,36.45 17.7,36.95 18.02,37.27 18.02,39.03 17.53,39.53 17.53,40.94 v17.92,41.33
SAI_BCK  (via drill 0.2)
  Top 0.13: IC1.B2 19.23,43.28 19.23,44.17 v18.6,44.8
  Top 0.15: IC3.6 11.51,17.55 v11.51,19.3
  InnerBottom 0.15: v18.6,44.8 18,45.4 9,45.4 6.45,42.85 6.45,24.59 7.6,23.45 7.6,21.57 9.86,19.3 v11.51,19.3
SAI_LRCK  (via drill 0.2)
  Top 0.15: v18.05,44.7 18.05,44.45 IC1.B1 | IC3.4 12.65,17.82 v12.65,19.68
  InnerBottom 0.15: v18.05,44.7 18.05,44.85 17.8,45.1 9.1,45.1 6.7,42.7 6.7,24.7 7.85,23.55 7.85,21.67 9.83,19.68 v12.65,19.68
SAI_MCLK  (via drill 0.2)
  Top 0.15: IC1.J14 v14.02,35.47 | IC3.5 12.15,17.63 v12.15,20.83
  InnerBottom 0.15: v8.75,34.82 8.42,34.82 7.95,34.35 7.95,25.21 9.35,23.81 9.35,21.6 10.13,20.83 v12.15,20.83
  Bottom 0.15: v8.75,34.82 10.75,34.82 11.85,35.92 13.57,35.92 v14.02,35.47
SAI_SDI  (via drill 0.2)
  Top 0.13: IC1.B3 19.22,42.62 19.81,42.62
  Top 0.15: v20.45,42.95 20.14,42.95 19.81,42.62 | IC3.7 11.51,16.85 v11.51,16.89
  InnerBottom 0.15: v20.45,42.95 20.8,43.3 20.8,44.65 19.55,45.9 8.7,45.9 5.95,43.15 5.95,24.39 7.1,23.24 7.1,21.31 v11.51,16.89
SAI_SDO  (via drill 0.2)
  Top 0.15: IC1.A1 v20.4,44.45 | IC3.2 13.85,18.17 13.15,18.87 v13.15,18.91
  InnerBottom 0.15: v20.4,44.45 19.2,45.65 8.84,45.65 6.2,43.01 6.2,24.49 7.35,23.34 7.35,21.43 9.85,18.92 13.14,18.92 v13.15,18.91
SPI3_MISO  (via drill 0.2)
  Top 0.13: IC1.B13 19.23,36.13 20.82,36.13
  Top 0.15: v25.91,35.86 25.11,35.86 24.9,35.65 21.3,35.65 20.82,36.13
  Bottom 0.15: JP2.20 27.99,36.4 26.95,36.4 26.41,35.86 v25.91,35.86
SPI3_MOSI  (via drill 0.2)
  Top 0.15: IC1.A12 19.8,36.7 21.5,36.7 21.85,37.05 25.25,37.05 26.3,36 v27.1,36
  Bottom 0.15: v27.1,36 27.81,36 JP2.22
SPI3_SCK  (via drill 0.2)
  Top 0.13: IC1.B14 19.22,35.47 20.23,35.47
  Top 0.15: 20.23,35.47 20.85,34.85 22.85,34.85 23.4,35.4 v25.4,35.4
  Bottom 0.15: v25.4,35.4 25.4,36 25.7,36.3 25.7,36.6 25.35,36.95 25.35,37.7 26.05,38.4 27.45,38.4 JP2.18
SPI6_MISO
  Top 0.15: JP2.19 26.43,38.33 25.61,39.15 21.45,39.15 21,38.7 19.85,38.7 IC1.A9
SPI6_MOSI
  Top 0.15: IC1.A7 19.64,39.79 22.11,39.79 22.2,39.7 24.8,39.7 26.05,40.95 26.92,40.95 27.48,40.4 27.48,35.64 26.68,34.84 JP2.21
SPI6_SCK
  Top 0.15: IC1.A8 19.78,39.05 19.88,38.95 20.85,38.95 21.35,39.45 25.96,39.45 JP2.17
SWDCLK  (via drill 0.2)
  Top 0.15: v23.6,34.8 23.4,34.6 20.7,34.6 20.15,35.15 IC1.A14
  InnerTop 0.15: v24.52,51.45 24.52,49.77 23.05,48.3 23.05,35.35 v23.6,34.8
  Bottom 0.15: v24.52,51.45 24.55,51.45 23.93,50.83 J1.4
SWDIO  (via drill 0.2)
  Top 0.15: IC1.A15 20,34.5 20.4,34.1 24.9,34.1 v25.3,34.5
  InnerTop 0.15: v25.9,48.95 24.6,47.65 24.6,35.55 25.3,34.85 v25.3,34.5
  Bottom 0.15: J1.2 25.29,49.56 v25.9,48.95
SWO  (via drill 0.2)
  Top 0.15: IC1.A10 19.65,37.65 23.23,37.65 v23.44,37.45
  InnerTop 0.15: v25.05,52.73 25.05,52.7 24.9,52.55 24.9,49.7 23.45,48.25 v23.45,37.45 v23.44,37.45
  Bottom 0.15: J1.6 24.45,52.1 25.05,52.7 v25.05,52.73
TIM2_CH1  (via drill 0.2)
  Top 0.15: IC1.A13 20.32,35.8 20.84,35.27 v22.14,35.27
  InnerTop 0.15: v21.45,52.9 22.3,52.05 22.3,35.7 22.14,35.54 v22.14,35.27
  InnerBottom 0.15: v5.8,43.6 5.7,43.7 5.7,52.75 6.05,53.1 21.25,53.1 v21.45,52.9
  Bottom 0.15: v5.8,43.6 4.65,42.45 4.65,39.2 3.93,38.48 3.08,38.48 1.98,37.38 JP1.19
TIM2_CH2  (via drill 0.2)
  Top 0.15: IC1.N2 v12.07,43.27
  Bottom 0.15: v12.07,43.27 11.37,43.97 6.76,43.97 4.95,42.16 4.95,38.76 JP1.20
TIM3_CH1  (via drill 0.2)
  Top 0.15: IC1.H15 15,34 14.93,33.93 v14.93,33.5 | v8.5,32.45 4.9,32.45 v4.7,32.65
  InnerBottom 0.15: v8.5,32.45 8.5,33.55 v8.7,33.75 | v4.7,32.65 4,33.35 2.53,33.35 JP1.21
  Bottom 0.15: v14.93,33.5 14.43,33.99 9.59,33.99 9.35,33.75 v8.7,33.75
TIM3_CH2  (via drill 0.2)
  Top 0.15: IC1.G15 15.65,34 v15.75,33.9 | JP1.22 4.47,34.84 5.01,34.3 v8.7,34.3
  Bottom 0.15: v15.75,33.9 15,33.9 14.6,34.3 v8.7,34.3
TIM4_CH1  (via drill 0.2)
  Top 0.15: IC1.N13 v11.43,36.12 | v2.8,36.3 3.9,36.3 4.5,35.7 v8.75,35.7
  Bottom 0.15: v11.43,36.12 9.17,36.12 v8.75,35.7 | JP1.23 2.1,33.37 2.1,35.6 v2.8,36.3
TIM4_CH2  (via drill 0.2)
  Top 0.15: IC1.M15 12.4,34.2 v11.8,33.6 | v8.45,35.27 8.02,34.84 4.96,34.84 3.92,35.87 2.97,35.87 v2.8,35.7
  Bottom 0.15: v8.45,35.27 8.27,35.09 8.27,33.42 8.6,33.1 11.3,33.1 v11.8,33.6 | v2.8,35.7 2.45,35.35 2.45,33.42 JP1.24
UART5_RX
  Top 0.15: JP2.15 25.78,41.81 25.78,41.5 25.33,41.05 21.8,41.05 21.1,40.35 IC1.A6
UART5_TX
  Top 0.13: IC1.B6 19.22,40.67 21.02,40.67
  Top 0.15: JP2.13 26.43,43.88 25.44,42.9 25.44,41.54 25.2,41.3 21.65,41.3 21.02,40.67
UART7_RX  (via drill 0.2)
  Top 0.15: IC1.F15 16.3,33.95 16.4,33.85 v16.4,33.4
  Bottom 0.15: JP2.16 27.95,41.44 27.95,39.3 27.3,38.65 25.9,38.65 24.9,37.65 24.9,34.4 24,33.5 16.5,33.5 v16.4,33.4
UART7_TX  (via drill 0.2)
  Top 0.15: IC1.K1 v13.7,44.45
  InnerTop 0.15: v27.2,43.55 27.52,43.55 JP2.14
  Bottom 0.15: v27.2,43.55 26.85,43.9 13.95,43.9 13.7,44.15 v13.7,44.45
USBD_D+  (via drill 0.2)
  Top 0.13: 18.92,34.5 19.24,34.82 20.08,34.82
  Top 0.15: v15,55.85 CN1.3 | IC1.B15 18.92,34.5 | JP2.7 25.25,53.8 v25.25,54.85 | 20.08,34.82 20.55,34.35 24.3,34.35 v24.5,34.55
  InnerTop 0.15: JP2.7 25.45,51.64 25.45,49.5 24.1,48.15 24.1,35.25 24.5,34.85 v24.5,34.55
  InnerBottom 0.15: v15,55.85 15.75,55.1 25,55.1 v25.25,54.85
USBD_D-  (via drill 0.2)
  Top 0.15: CN1.2 v14.35,56.25 | IC1.C15 18.25,34.05 18.51,33.79 24.06,33.79 24.2,33.65 v24.75,33.65
  InnerTop 0.15: JP2.5 25.43,54.16 25.43,52.08 25.15,51.8 25.15,49.6 23.85,48.3 23.85,35.1 24.1,34.85 24.1,34.3 v24.75,33.65
  InnerBottom 0.15: v14.35,56.25 15.15,56.25 15.95,55.45 25.79,55.45 26.08,55.16 JP2.5
USBD_ID  (via drill 0.2)
  Top 0.15: CN1.4 15.65,56.25 16.05,55.85 v16.1,55.85 | IC1.D15 17.6,33.86 17.95,33.52 23.9,33.52 24.15,33.27 24.9,33.27 v25.3,33.67
  InnerTop 0.15: v26.9,56.35 27.45,55.8 27.45,51.1 JP2.9 24.35,48 24.35,35.4 24.92,34.83 24.92,34.04 v25.3,33.67
  InnerBottom 0.15: v26.9,56.35 25.95,56.35 25.45,55.85 v16.1,55.85
USBD_VBUS  (via drill 0.2)
  Top 0.15: CN1.1 v13.7,56.25 | IC1.E15 16.95,34.05 17.75,33.25 23.78,33.25 24.21,32.81 v24.77,32.81
  InnerTop 0.15: JP2.3 24.15,55.42 24.15,51.75 24.15,50.55 22.55,48.95 22.55,34.83 24.56,32.81 v24.77,32.81
  InnerBottom 0.15: v13.7,56.25 14.1,56.65 15.3,56.65 15.7,56.25 24.98,56.25 JP2.3
USBH_D+  (via drill 0.2)
  Top 0.15: IC1.R15 9.7,33.75 9.7,33.4 9.15,32.85 5.67,32.85 5.57,32.95 v5.17,32.95
  InnerBottom 0.15: JP2.8 27.8,51.45 25.75,51.45 23.6,53.6 5.75,53.6 5.15,53 5.15,34.35 5.4,34.1 5.4,33.18 v5.17,32.95
USBH_D-  (via drill 0.2)
  Top 0.15: IC1.R14 9.45,34.15 9.45,33.55 9,33.1 5.8,33.1 5.55,33.35 4.8,33.35 v4.7,33.25
  InnerBottom 0.15: JP2.6 28.32,54.51 27.72,54.51 27.06,53.85 5.6,53.85 4.9,53.15 4.9,34.25 5.15,34 5.15,33.55 4.85,33.25 v4.7,33.25
USBH_ID  (via drill 0.2)
  Top 0.13: IC1.P12 10.77,36.12 9.53,36.12
  Top 0.15: v5.55,36.15 5.9,36.5 9.15,36.5 9.53,36.12
  InnerBottom 0.15: JP2.10 27.85,51.2 25.6,51.2 23.45,53.35 5.9,53.35 5.4,52.85 5.4,36.6 5.55,36.45 v5.55,36.15
USBH_VBUS  (via drill 0.2)
  Top 0.13: 10.28,35.47 10.77,35.47 IC1.P13
  Top 0.15: 10.28,35.47 9.2,34.39 9.2,33.65 8.9,33.35 5.95,33.35 5.5,33.8 v4.73,33.8 v4.72,33.81
  InnerBottom 0.15: JP2.4 27.75,56.48 27.75,54.95 26.95,54.15 5.55,54.15 4.65,53.25 4.65,33.88 v4.72,33.81

## Text on the board
bPlace: 2 1 | 96 95 | 3 | 94 | 5 | 7 | 9 | 11 | 86 | 13 | 84 | 15 | 82 | 17 | 80 | PDR | 19 | 78 | BOOT | 21 | 76 | 23 | 74 | 25 | 72 | 27 | 70 | 29 | 68 | 31 | 66 | 33 | 64 | Xibeca Rev02 | 35 | 62 | 37 | 60 | 39 | 58 | 41 | 56 | 43 | 54 | 45 | 52 | 48 47 | 50 49